# Altium schematic sheet EEG Signal Input.SchDoc
size A2; SheetNumber: 6; SheetTotal: 9
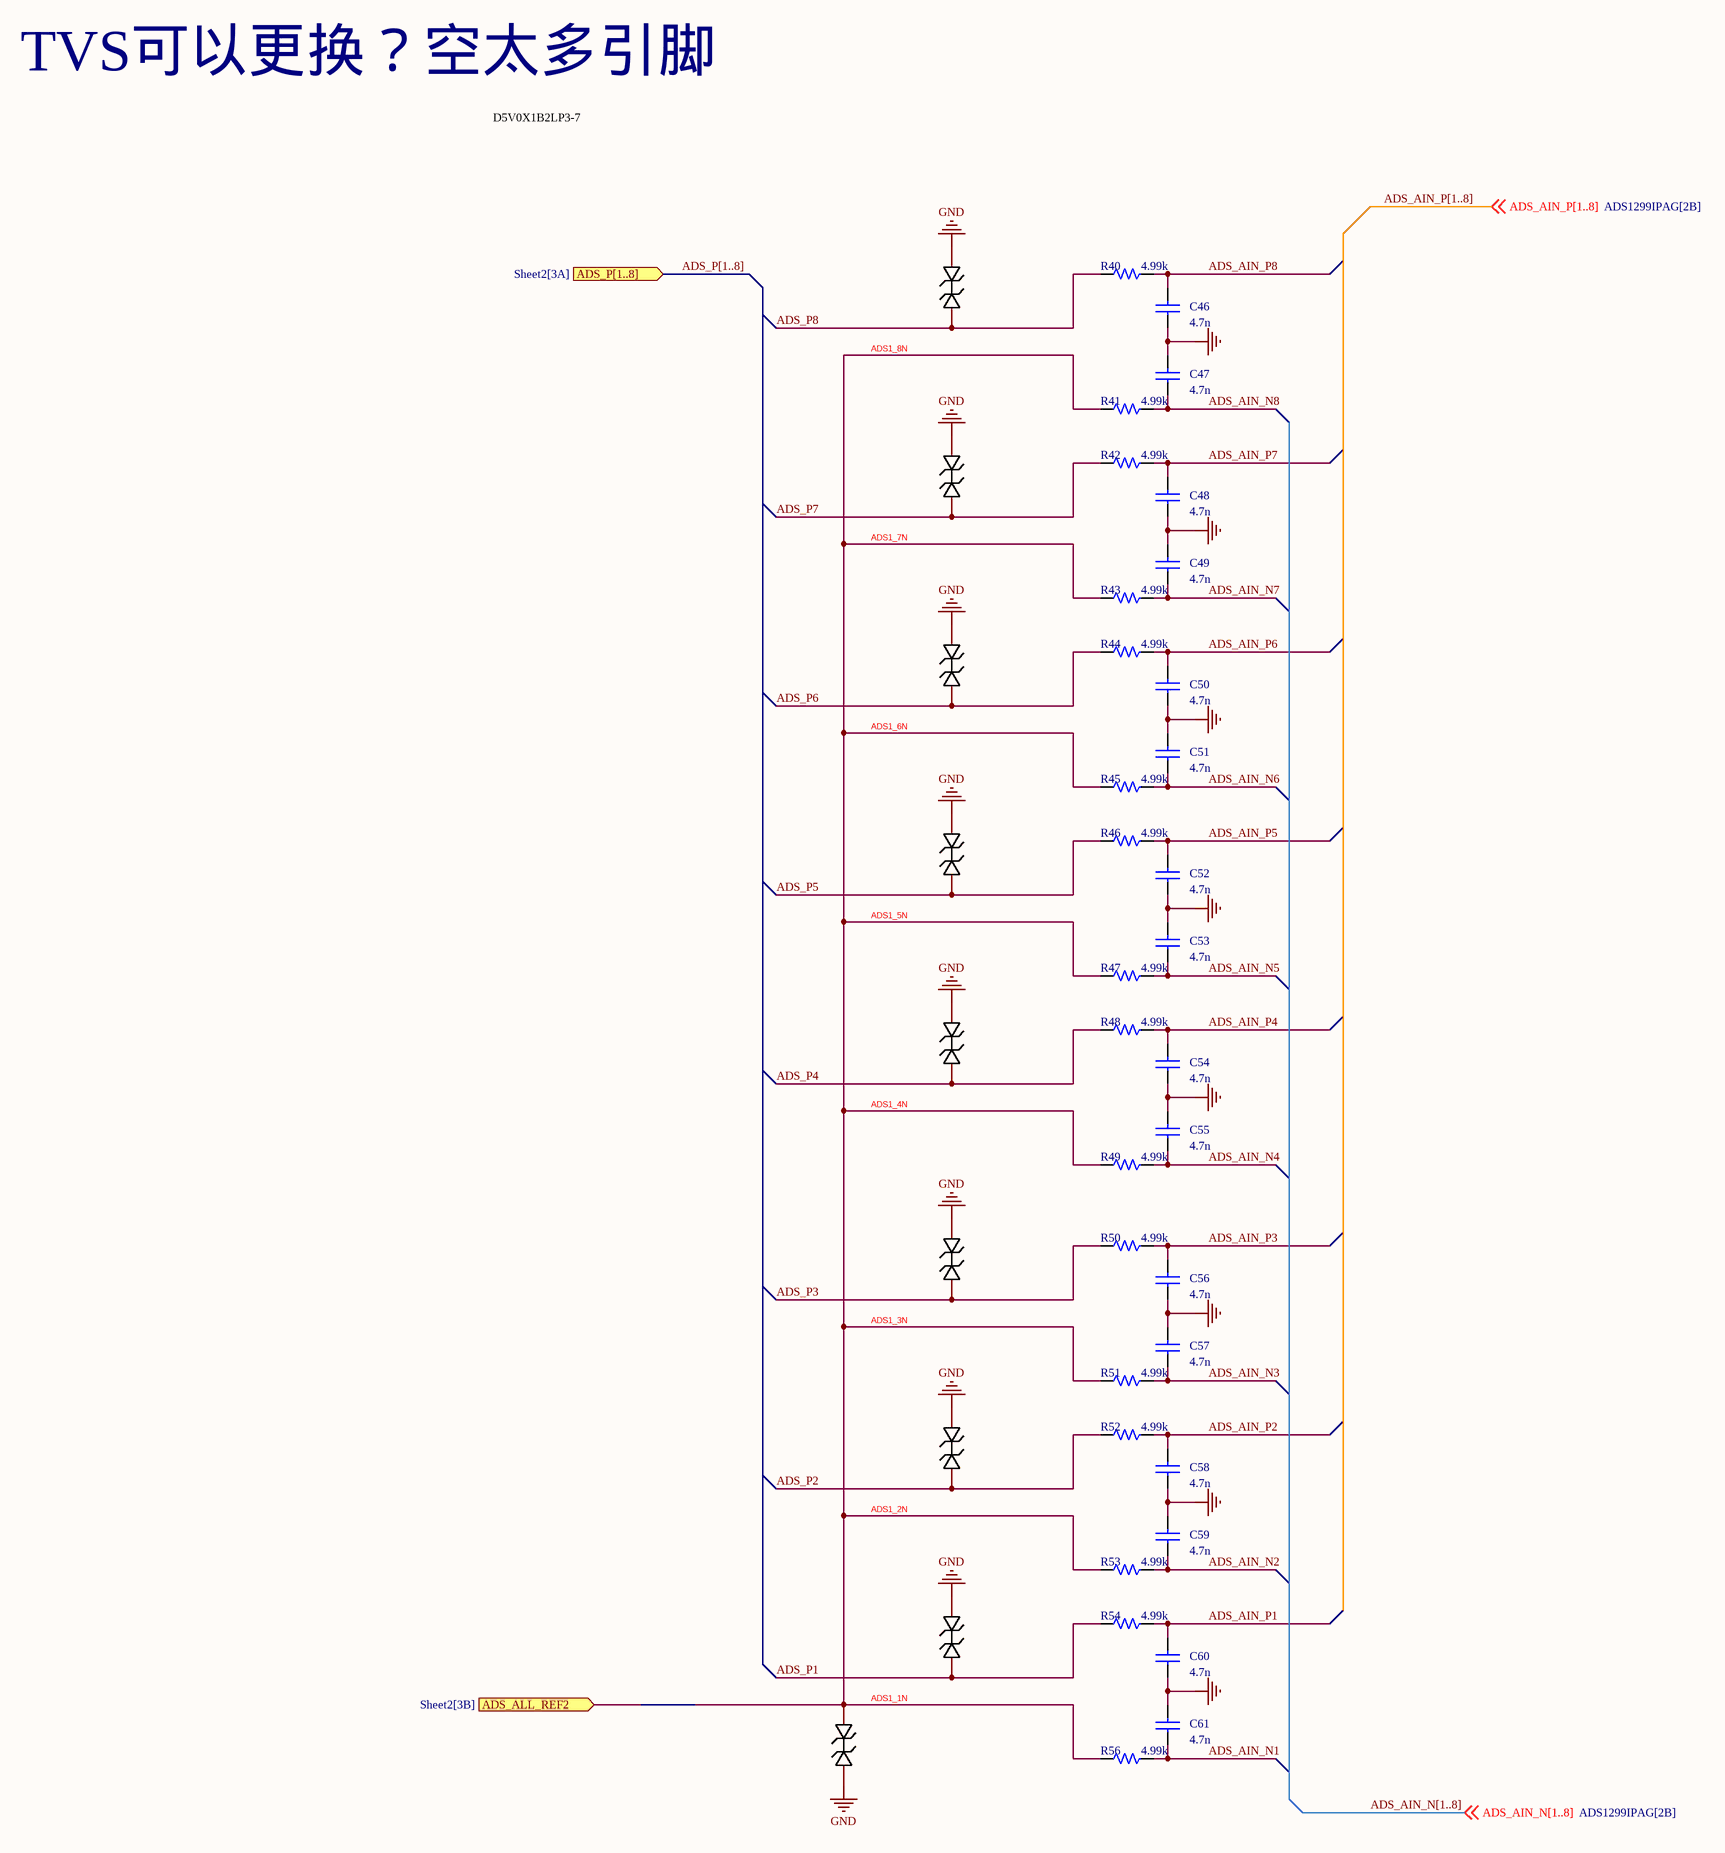
[diagram p0: EEG Signal Input.SchDoc]

## Parts
C46  4.7n  [0201_C]
C47  4.7n  [0201_C]
C48  4.7n  [0201_C]
C49  4.7n  [0201_C]
C50  4.7n  [0201_C]
C51  4.7n  [0201_C]
C52  4.7n  [0201_C]
C53  4.7n  [0201_C]
C54  4.7n  [0201_C]
C55  4.7n  [0201_C]
C56  4.7n  [0201_C]
C57  4.7n  [0201_C]
C58  4.7n  [0201_C]
C59  4.7n  [0201_C]
C60  4.7n  [0201_C]
C61  4.7n  [0201_C]
D4  D5V0X1B2LP3-7  [X3-DFN0603-2_L0.6-W0.3-BI]  (value not drawn)
D5  D5V0X1B2LP3-7  [X3-DFN0603-2_L0.6-W0.3-BI]  (value not drawn)
D6  D5V0X1B2LP3-7  [X3-DFN0603-2_L0.6-W0.3-BI]  (value not drawn)
D7  D5V0X1B2LP3-7  [X3-DFN0603-2_L0.6-W0.3-BI]  (value not drawn)
D8  D5V0X1B2LP3-7  [X3-DFN0603-2_L0.6-W0.3-BI]  (value not drawn)
D9  D5V0X1B2LP3-7  [X3-DFN0603-2_L0.6-W0.3-BI]  (value not drawn)
D10  D5V0X1B2LP3-7  [X3-DFN0603-2_L0.6-W0.3-BI]  (value not drawn)
D11  D5V0X1B2LP3-7  [X3-DFN0603-2_L0.6-W0.3-BI]  (value not drawn)
D12  D5V0X1B2LP3-7  [X3-DFN0603-2_L0.6-W0.3-BI]  (value not drawn)
R40  4.99k  [0201_R]
R41  4.99k  [0201_R]
R42  4.99k  [0201_R]
R43  4.99k  [0201_R]
R44  4.99k  [0201_R]
R45  4.99k  [0201_R]
R46  4.99k  [0201_R]
R47  4.99k  [0201_R]
R48  4.99k  [0201_R]
R49  4.99k  [0201_R]
R50  4.99k  [0201_R]
R51  4.99k  [0201_R]
R52  4.99k  [0201_R]
R53  4.99k  [0201_R]
R54  4.99k  [0201_R]
R56  4.99k  [0201_R]

## Ports
ADS_ALL_REF2 (in, see Sheet2[3B]), ADS_P[1..8] (in, see Sheet2[3A])

## Nets
GND: C46.1 C47.2 C48.1 C49.2 C50.1 C51.2 C52.1 C53.2 C54.1 C55.2 C56.1 C57.2 C58.1 C59.2 C60.1 C61.2 D4.2 D5.2 D6.2 D7.2 D8.2 D9.2 D10.2 D11.2 D12.2
ADS1_1N: D12.1 R41.2 R43.2 R45.2 R47.2 R49.2 R51.2 R53.2 R56.2 ; port ADS_ALL_REF2  [also labelled ADS1_2N, ADS1_3N, ADS1_4N, ADS1_5N, ADS1_6N, ADS1_7N, ADS1_8N]
ADS_AIN_N1: C61.1 R56.1
ADS_AIN_N2: C59.1 R53.1
ADS_AIN_N3: C57.1 R51.1
ADS_AIN_N4: C55.1 R49.1
ADS_AIN_N5: C53.1 R47.1
ADS_AIN_N6: C51.1 R45.1
ADS_AIN_N7: C49.1 R43.1
ADS_AIN_N8: C47.1 R41.1
ADS_AIN_P1: C60.2 R54.1
ADS_AIN_P2: C58.2 R52.1
ADS_AIN_P3: C56.2 R50.1
ADS_AIN_P4: C54.2 R48.1
ADS_AIN_P5: C52.2 R46.1
ADS_AIN_P6: C50.2 R44.1
ADS_AIN_P7: C48.2 R42.1
ADS_AIN_P8: C46.2 R40.1
ADS_P1: D11.1 R54.2
ADS_P2: D10.1 R52.2
ADS_P3: D9.1 R50.2
ADS_P4: D8.1 R48.2
ADS_P5: D7.1 R46.2
ADS_P6: D6.1 R44.2
ADS_P7: D5.1 R42.2
ADS_P8: D4.1 R40.2

## Buses and harness runs
bus ADS_AIN_N[1..8]
bus ADS_AIN_P[1..8]
bus ADS_P[1..8] = port ADS_P[1..8]

## Notes on the sheet
- TVS可以更换？空太多引脚
- D5V0X1B2LP3-7

## Library data of the parts
C46-C61 = CAP0402: CAP CER 4700PF 50V X7R 0402; Part Number: CC0402KRX7R9BB472; Manufacturer: YAGEO; FPLIST: 0402_smd; PCB Footprint: C0603; Distributor: LCSC; Distributor Part Number: C106208; Distributor Link: https://item.szlcsc.com/107423.html; Manufacturer Part Number: CC0402KRX7R9BB472
D4-D12 = D5V0X1B2LP3-7: Manufacturer: DIODES(美台); Add into BOM: yes; Reverse Stand-Off Voltage (Vrwm): 5.5V; Breakdown Voltage (VBR): 7V; Clamping Voltage@Ipp: 14V; Junction Capacitance(Cj)@1MHz: 0.3pF@1MHz; Name: D5V0X1B2LP3-7; Symbol: D5V0X1B2LP3-7; Device: D5V0X1B2LP3-7; LCSC Part Name: D5V0X1B2LP3-7; Supplier Part: C526514; Manufacturer Part: D5V0X1B2LP3-7; Supplier Footprint: X3-DFN0603-2; JLCPCB Part Class: Extended Part; Datasheet: https://atta.szlcsc.com/upload/public/pdf/source/20200528/C526514_1B9BA5DE30498B0D24898FE9BE74AB8A.pdf; Supplier: LCSC; Convert to PCB: yes; Peak Pulse Power(Ppp)@8/20us: -; Operating Temperature: -65℃~+150℃@(Tj)
R40 R41 R44 R45 R52 R53 = RES: RES SMD 4.99K OHM 1% 1/16W 0402; Manufacturer: YAGEO; Manufacturer Part Number: RC0402FR-074K99L; PCB Footprint: R0402; Part Number: RC0402FR-074K99L; Distributor Part Number: C137965; Distributor: LCSC; Distributor Link: https://item.szlcsc.com/149281.html
R42 R43 R46-R51 R54 R56 = RES: RES SMD 4.99K OHM 1% 1/16W 0402; Part Number: RC0402FR-074K99L; Manufacturer: YAGEO; PCB Footprint: R0402; Distributor Link: https://item.szlcsc.com/149281.html; Distributor: LCSC; Distributor Part Number: C137965; Manufacturer Part Number: RC0402FR-074K99L